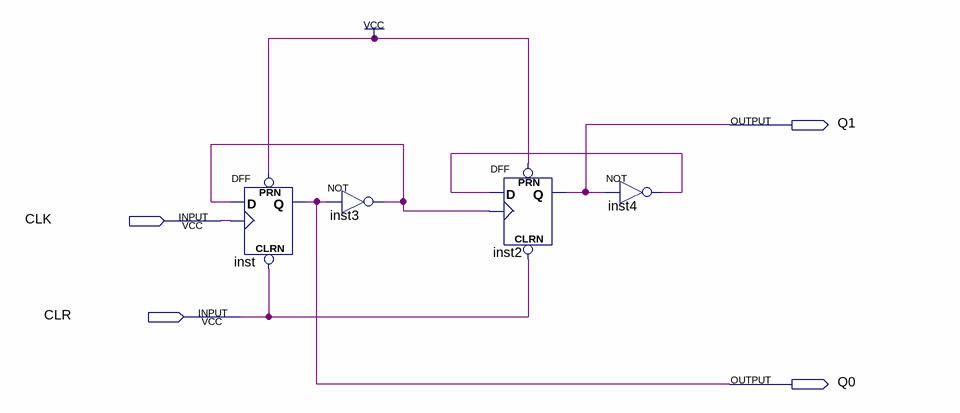
[diagram p0: schematic sheet]
// Quartus schematic mod4add1.bdf as structural Verilog: 4 symbols, 4 pins
module mod4add1 (
  input  CLK,
  input  CLR,
  output Q1,
  output Q0
);

  wire inst3_out, inst4_out;

  DFF inst (.CLRN(CLR), .CLK(CLK), .D(inst3_out), .PRN(1'b1), .Q(Q0));
  not inst3 (inst3_out, Q0);
  DFF inst2 (.CLRN(CLR), .CLK(inst3_out), .D(inst4_out), .PRN(1'b1), .Q(Q1));
  not inst4 (inst4_out, Q1);
endmodule
